# EAGLE design minimatrix (EAGLE 6.4)
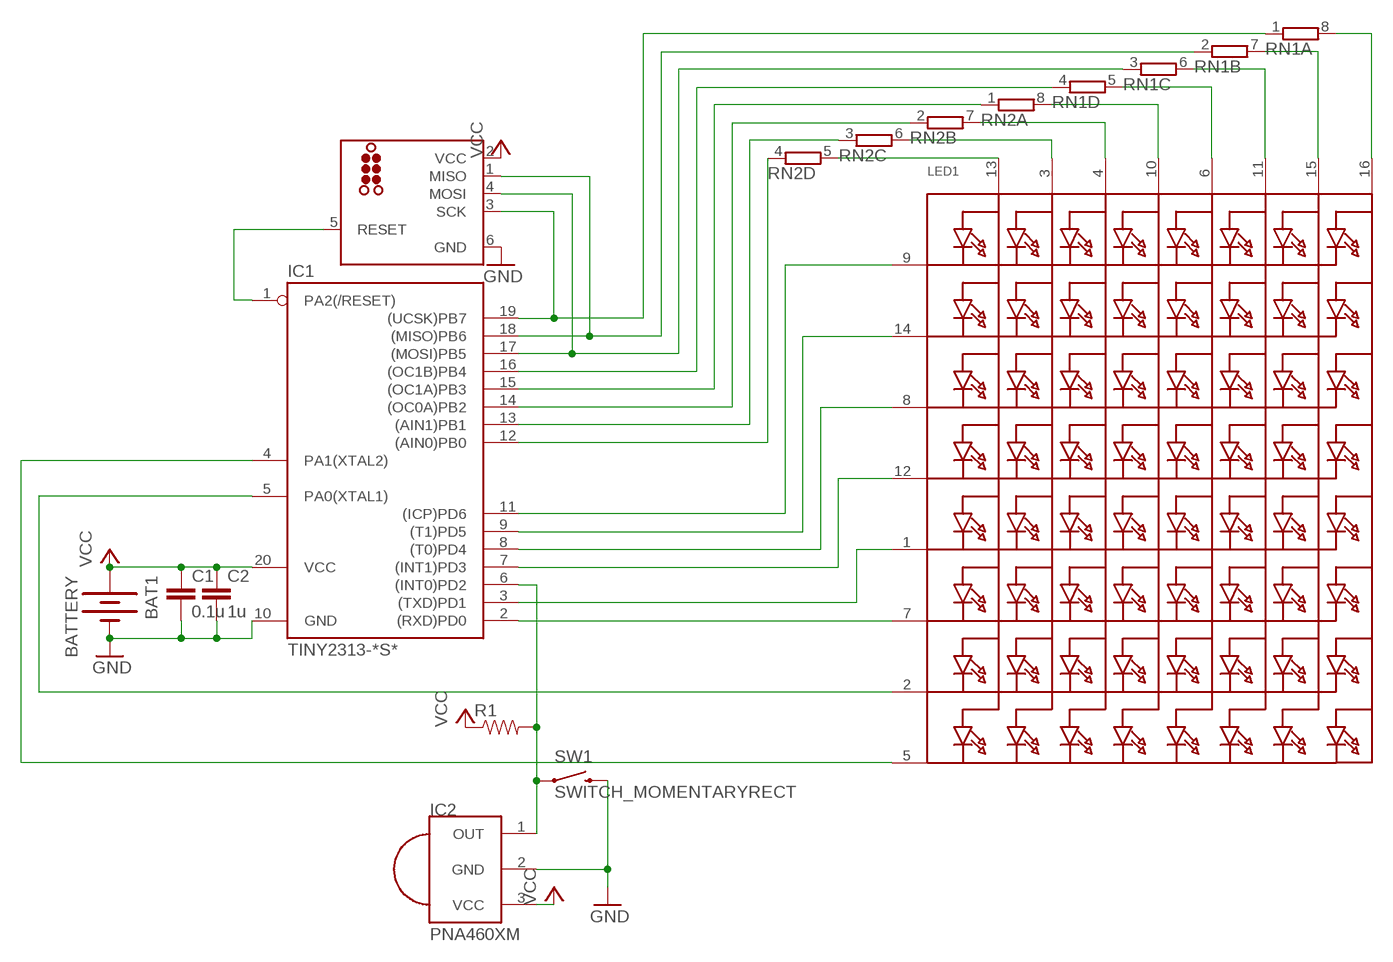
[diagram p0: schematic, sheet 1]

## Parts
BAT1  BATTERY  [COINCELL_PTH]
C1  0.1u  CAP0805  [0805]
C2  1u  CAP0805  [0805]
IC1  TINY2313-*S*  [SO20L$]
IC2  PNA460XM  [PNA460XM]
LED1  SEGMENT_8X8_ROWCATHODEM12A881UR  [SEGMENT_BL-M12A881UR]
R1  RESISTOR0805-RES  [0805]
RN1  4R-NCAY16  [CAY16]
RN2  4R-NCAY16  [CAY16]
SW1  SWITCH_MOMENTARYRECT  [SWITCH_MOMENTARY_RECT]
U$3  TC2030_AVRMCP-NL  [TC2030-MCP-NL]

## Nets
C2: IC1.13((AIN1)PB1) RN2.3
C3: IC1.14((OC0A)PB2) RN2.2
C4: IC1.15((OC1A)PB3) RN2.1
C5: IC1.16((OC1B)PB4) RN1.4
COL1: IC1.12((AIN0)PB0) RN2.4
GND: BAT1.NEG(-) C1.2 C2.2 IC1.10(GND) IC2.2(GND) SW1.P$2 U$3.6(GND)
MISO: IC1.18((MISO)PB6) RN1.2 U$3.1(MISO)
MOSI: IC1.17((MOSI)PB5) RN1.3 U$3.4(MOSI)
N$1: IC1.2((RXD)PD0) LED1.7(K6)
N$3: LED1.3(A2) RN2.6
N$4: LED1.4(A3) RN2.7
N$5: LED1.10(A4) RN2.8
N$6: LED1.6(A5) RN1.5
N$7: LED1.11(A6) RN1.6
N$8: LED1.15(A7) RN1.7
N$9: LED1.16(A8) RN1.8
N$10: LED1.13(A1) RN2.5
N$11: IC1.3((TXD)PD1) LED1.1(K5)
N$12: IC1.4(PA1(XTAL2)) LED1.5(K8)
N$13: IC1.6((INT0)PD2) IC2.1(OUT) R1.2 SW1.P$1
R2: IC1.9((T1)PD5) LED1.14(K2)
R3: IC1.8((T0)PD4) LED1.8(K3)
R4: IC1.7((INT1)PD3) LED1.12(K4)
R7: IC1.5(PA0(XTAL1)) LED1.2(K7)
RESET: IC1.1(PA2(/RESET)) U$3.5(RESET)
ROW1: IC1.11((ICP)PD6) LED1.9(K1)
SCK: IC1.19((UCSK)PB7) RN1.1 U$3.3(SCK)
VCC: BAT1.POS1(+) BAT1.POS2(+) C1.1 C2.1 IC1.20(VCC) IC2.3(VCC) R1.1 U$3.2(VCC)

## Library data of the parts
BAT1 = nickparts:BATTERY
C1 C2 = SparkFun-Passives:CAP: Capacitor Standard 0603 ceramic capacitor, and 0.1" leaded capacitor.
IC1 = avr-7:TINY2313*: Atmel Tiny2313 2K Flash, 128 bytes EEPROM, 128 bytes RAM
IC2 = adafruit:PNA460XM: IR 38KHz receiver PNA4602 and related receivers http://www.ladyada.net/library/pcb/eaglelibrary.html
LED1 = adafruit:SEGMENT_8X8_ROWCATHODE: 8x8 LED Segment Displays: Row = Cathode 0.7" Red 8X8 Matrix, 1.9mm Round LEDs - BL-M07C881UR 1.2" Red 8x8 Matrix, 3.0mm Round LEDs - BL-M12A881UR 1.2" Red 8x8 Matrix, 3.0mm Square LEDs - BL-M12A883
R1 = SparkFun-Passives:RESISTOR: Resistor Basic schematic elements and footprints for 0603, 1206, and PTH resistors.
RN1 RN2 = resistor-dil:4R-N: Array Chip Resistor Source: RS Component / Phycomp; OC_FARNELL: unknown; OC_NEWARK: unknown
SW1 = nickparts:SWITCH_MOMENTARY
U$3 = tag-connect:TC2030_AVR

## Board
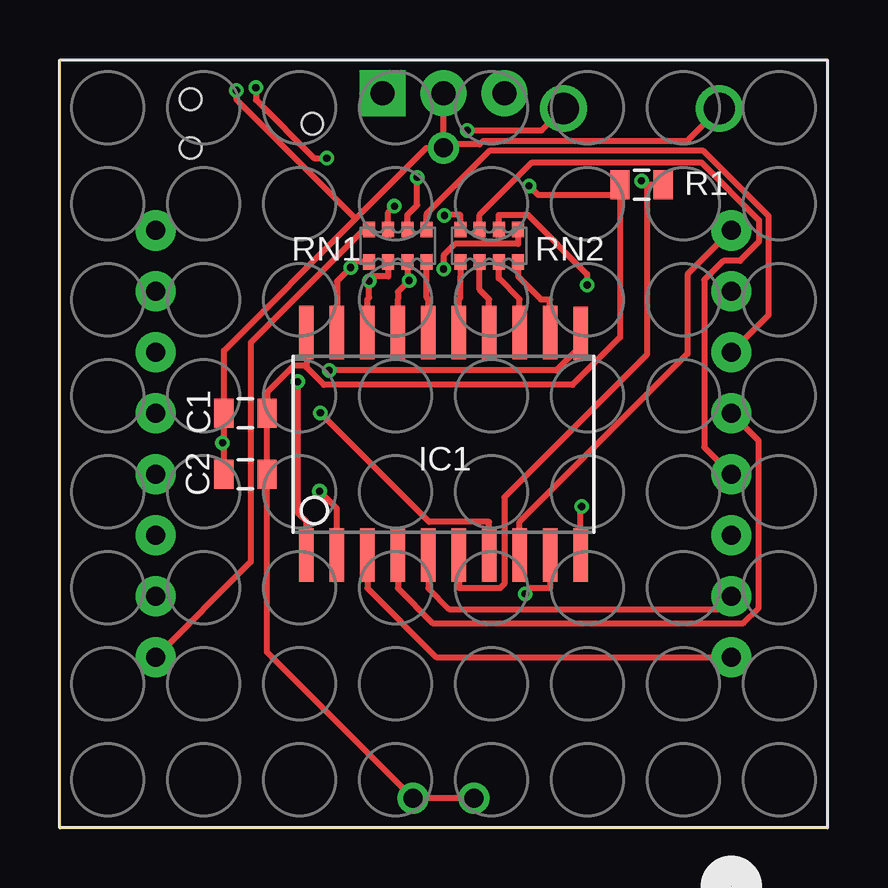
[diagram p1: board, top side]
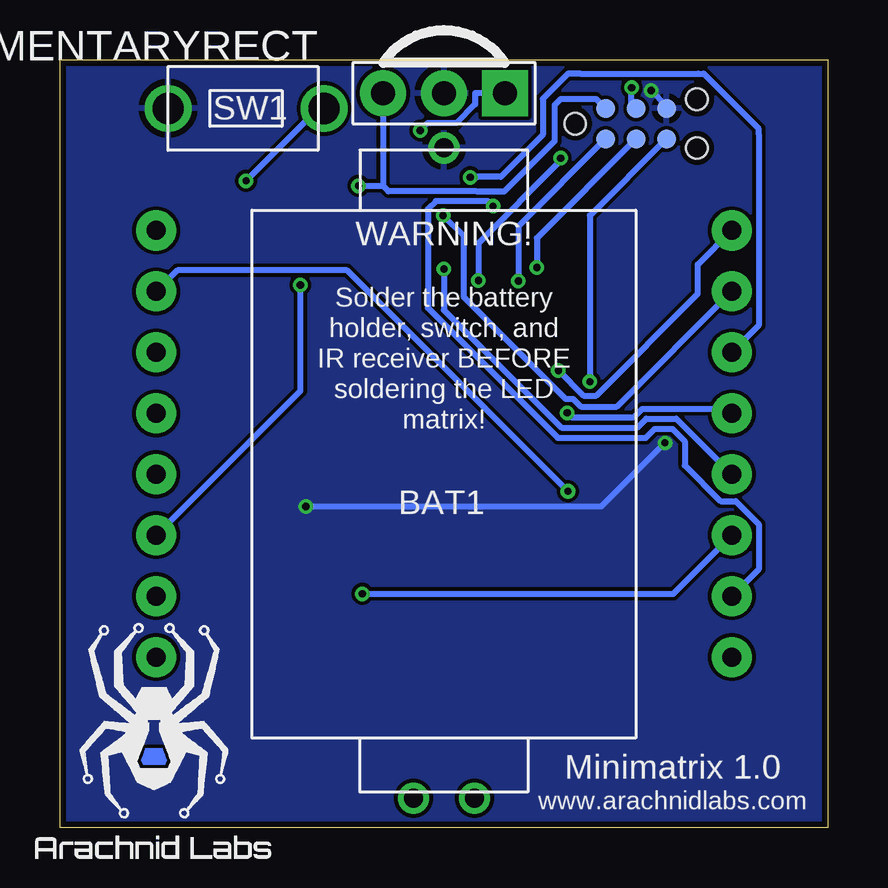
[diagram p2: board, bottom side, seen from below]

Size 32 x 32 mm. Coordinates in mm from the lower left corner, seen from the top.
Outline: 32,0 32,32 0,32 0,0 32,0
Copper layers (1*16): Top 0.035mm / dielectric 1.5mm / Bottom 0.035mm
Design rules "default": minimum track width 6mil, minimum drill 0.3mm, track to track 6mil, track to pad 6mil, pad to pad 6mil, via to via 6mil, smd to smd 0mil, copper to edge 10mil, drill to drill 10mil, minimum pad ring 10mil, minimum via ring 6mil, stop-mask expansion 2mil, vias tented up to drill 100mil, thermal gap 10mil

### Footprints (pad centres in the part's own frame; a part is rotated, then mirrored left to right if it is on the bottom)
COINCELL_PTH = drill 0.8: NEG -13.6,0; POS1 13.5,1.27; POS2 13.5,-1.27
0805 = smd 0.8 x 1.2: 1 -0.9,0; 2 0.9,0
SO20L$ = smd 0.61 x 2.21: 1 -5.715,-4.636; 2 -4.445,-4.636; 3 -3.175,-4.636; 4 -1.905,-4.636; 5 -0.635,-4.636; 6 0.635,-4.636; 7 1.905,-4.636; 8 3.175,-4.636; 9 4.445,-4.636; 10 5.715,-4.636; 11 5.715,4.61; 12 4.445,4.636; 13 3.175,4.636; 14 1.905,4.636; 15 0.635,4.636; 16 -0.635,4.636; 17 -1.905,4.636; 18 -3.175,4.636; 19 -4.445,4.636; 20 -5.715,4.636
PNA460XM = drill 1.016 pad 1.93 square: 1 -2.54,0 | drill 1.016 pad 1.93: 2 0,0; 3 2.54,0
SEGMENT_BL-M12A881UR = drill 0.8 pad 1.676: 1 -8.89,-12; 2 -6.35,-12; 3 -3.81,-12; 4 -1.27,-12; 5 1.27,-12; 6 3.81,-12; 7 6.35,-12; 8 8.89,-12; 9 8.89,12; 10 6.35,12; 11 3.81,12; 12 1.27,12; 13 -1.27,12; 14 -3.81,12; 15 -6.35,12; 16 -8.89,12
CAY16 = smd 0.5 x 0.65: 1 -1.2,-0.675; 2 -0.4,-0.675; 3 0.4,-0.675; 4 1.2,-0.675; 5 1.2,0.675; 6 0.4,0.675; 7 -0.4,0.675; 8 -1.2,0.675
SWITCH_MOMENTARY_RECT = drill 1.3: P$1 -3.25,0; P$2 3.25,0
TC2030-MCP-NL = smd 0.787 x 0.787: 1 1.27,-0.635; 2 1.27,0.635; 3 2.54,-0.635; 4 2.54,0.635; 5 3.81,-0.635; 6 3.81,0.635 | hole 0.889: 0,0; 5.08,-1.016; 5.08,1.016

### Placement (x,y rotation side)
BAT1  15.99,14.74 270 bottom
C1  7.74,17.28 180 top
C2  7.74,14.74 180 top
IC1  15.99,16.01 0 top
IC2  15.99,30.62 180 bottom
LED1  15.99,16.01 90 top
R1  24.24,26.81 0 top
RN1  14.09,24.27 0 top
RN2  17.89,24.27 0 top
SW1  24.24,29.98 180 bottom
U$3  10.53,29.35 0 bottom
U$4  [ARACHNID_LABS_LOGO_SM]  28.11,3.63 0 bottom

### Tracks (layer width: path | path; a pad name or v marks a point on that pad's centre or on a via)
C2
  Top 0.254: IC1.13 19.16,22.03 18.29,22.9 RN2.3
C3
  Top 0.254: IC1.14 17.89,22.03 17.49,22.43 RN2.2
C4
  Top 0.254: RN2.1 16.69,22.99 16.69,22.1 16.62,22.03 IC1.15
C5
  Top 0.254: RN1.4 15.29,22.1 15.36,22.03 IC1.16
COL1
  Top 0.254: RN2.4 19.09,22.99 20.05,22.03 20.43,22.03 IC1.12
GND  (via drill 0.3 pad 0.6)
  Top 0.254: SW1.P$2 26.14,28.62 17.64,28.62 17.49,28.48 15.99,28.48 | 15.99,28.48 IC2.2 | 15.99,28.48 BAT1.NEG 15.28,28.34 12.64,25.7 12.33,25.39 | 12.33,25.39 6.83,19.9 C1.2 6.83,16.05 | C2.2 6.83,16.05 | v6.78,16.05 6.83,16.05 | IC1.10 21.7,13.36 v21.75,13.4 | v7.35,30.73 7.35,30.37 12.33,25.39
  Bottom 0.254: v7.35,30.73 6.71,30.1 U$3.6 | v21.75,13.4 9.43,13.4 v6.78,16.05
  pour Bottom: 0.12,0.14 0.12,31.89 31.86,31.89 31.86,0.14
MISO  (via drill 0.3 pad 0.6)
  Top 0.254: IC1.18 12.81,22.03 12.89,22.1 v12.89,22.79 13.08,22.99 13.69,22.99 RN1.2
  Bottom 0.254: U$3.1 12.89,25.08 v12.89,22.79
MOSI  (via drill 0.3 pad 0.6)
  Top 0.254: v8.17,30.85 8.17,30.34 10.59,27.91 v11.13,27.91 | RN1.3 14.48,22.99 14.48,22.88 v14.56,22.81 14.09,22.34 14.09,22.03 IC1.17
  Bottom 0.254: v11.13,27.91 11.13,27.81 14.56,24.38 v14.56,22.81 | U$3.4 8.17,30.16 v8.17,30.85
N$1  (via drill 0.3 pad 0.6)
  Top 0.254: IC1.2 11.54,13.31 v10.82,14.03
  Bottom 0.254: v10.82,14.03 20.03,23.24 27.11,23.24 LED1.7
N$3  (via drill 0.3 pad 0.6)
  Top 0.254: RN2.6 18.29,25.55 19.52,25.55 21.98,23.08 v21.98,22.63
  Bottom 0.254: LED1.3 21.98,18.21 v21.98,22.63
N$4
  Top 0.254: RN2.7 17.49,25.55 19.68,27.73 26.74,27.73 29.14,25.33 29.14,24.43 28.35,23.63 27.66,23.63 26.86,22.84 26.86,15.87 LED1.4
N$5  (via drill 0.3 pad 0.6)
  Top 0.254: v16.03,25.52 16.05,25.55 16.69,25.55 RN2.8
  Bottom 0.254: v16.03,25.52 15.18,24.67 15.18,22.14 10.92,17.88 10.61,17.88 10.29,17.56 8.79,17.56 LED1.10
N$6
  Top 0.254: LED1.6 29.55,21.38 29.55,25.5 26.83,28.22 17.9,28.22 15.29,25.6 15.29,25.55 RN1.5
N$7  (via drill 0.3 pad 0.6)
  Top 0.254: v14.89,27.11 14.89,25.95 14.48,25.55 RN1.6
  Bottom 0.254: 14.63,27.11 v14.89,27.11 14.87,27.14 13.62,27.14 11.87,28.89 11.87,30.39 10.82,31.43 10.3,31.43 5.39,31.43 5.16,31.43 2.87,29.14 2.87,28.91 2.87,20.94 LED1.11
N$8  (via drill 0.3 pad 0.6)
  Top 0.254: RN1.7 13.69,25.65 v13.95,25.91
  Bottom 0.254: v13.95,25.91 14.16,26.12 16.33,26.12 16.66,25.79 16.66,21.67 11.24,16.25 7.58,16.25 7.2,16.64 6.46,16.64 5.95,16.12 5.95,15.11 4.47,13.62 3.83,13.62 2.87,12.66 2.87,10.78 LED1.15
N$9
  Top 0.254: RN1.8 12.67,24.94 7.96,20.23 7.96,11.08 LED1.16
N$10  (via drill 0.3 pad 0.6)
  Top 0.254: RN2.5 19.09,24.34 16.47,24.34 15.99,23.86 v15.99,23.29
  Bottom 0.254: v15.99,23.29 15.99,21.58 11.1,16.69 7.93,16.69 7.56,17.05 6.3,17.05 LED1.13
N$11
  Top 0.254: IC1.3 12.81,9.99 15.69,7.12 LED1.1
N$12
  Top 0.254: IC1.4 14.09,9.99 15.54,8.54 28.5,8.54 29.13,9.16 29.13,16.14 LED1.5
N$13  (via drill 0.3 pad 0.6)
  Top 0.254: 24.47,26.81 24.47,19.71 18.53,13.78 18.53,10.17 18.34,9.99 16.62,9.99 IC1.6 | R1.2 24.47,26.81 | v24.24,26.96 24.31,26.96 24.47,26.81 | SW1.P$1 20.08,29.06 v16.98,29.06
  Bottom 0.254: SW1.P$1 21.23,29.98 v24.24,26.96 | IC2.1 14.7,30.62 14.7,30.15 15.47,29.37 16.67,29.37 v16.98,29.06
R2  (via drill 0.3 pad 0.6)
  Top 0.254: IC1.9 20.43,9.99 19.63,9.99 v19.39,9.76
  Bottom 0.254: v19.39,9.76 6.43,9.76 LED1.14
R3
  Top 0.254: LED1.8 26.16,23.07 26.16,19.76 19.16,12.76 IC1.8
R4  (via drill 0.3 pad 0.6)
  Top 0.254: v10.85,17.3 15.39,12.76 17.89,12.76 IC1.7
  Bottom 0.254: v10.85,17.3 10.66,17.11 8.08,17.11 7.73,17.46 4.17,17.46 LED1.12
R7
  Top 0.254: IC1.5 15.36,9.99 16.23,9.12 27.45,9.12 LED1.2
RESET  (via drill 0.3 pad 0.6)
  Top 0.254: v9.91,18.6 9.91,13.12 10.28,12.76 IC1.1
  Bottom 0.254: U$3.5 9.91,25.52 v9.91,18.6
ROW1  (via drill 0.3 pad 0.6)
  Top 0.254: IC1.11 21.7,20.07 20.7,19.07 v11.22,19.07
  Bottom 0.254: v11.22,19.07 10.17,18.02 9.65,18.02 5.41,22.25 5.41,23.48 LED1.9
SCK  (via drill 0.3 pad 0.6)
  Top 0.254: v12.12,23.35 11.54,22.78 IC1.19 | v12.12,23.35 12.36,23.59 RN1.1 | v12.12,23.35
  Bottom 0.254: U$3.3 12.12,24.58 v12.12,23.35
VCC  (via drill 0.3 pad 0.6)
  Top 0.254: 23.34,26.37 19.94,26.37 v19.55,26.76 | 23.34,26.37 23.34,25.93 23.34,20.44 21.37,18.46 11.01,18.46 10.28,19.19 10.28,19.26 | R1.1 23.34,26.37 | 10.28,19.26 9.74,19.26 8.63,18.16 C1.1 C2.1 8.63,7.33 BAT1.POS1 BAT1.POS2 | IC1.20 10.28,19.26
  Bottom 0.254: 18.53,26.76 18.3,26.53 14.63,26.53 13.47,26.53 11.37,28.64 11.37,30.14 11.12,30.39 9.66,30.39 U$3.2 | IC2.3 18.53,26.76 | v19.55,26.76 18.53,26.76

### Text on the board
bNames: WARNING! | Solder the battery | holder, switch, and | IR receiver BEFORE | soldering the LED | matrix! | Minimatrix 1.0 | www.arachnidlabs.com